# Altium project SpaceVNXBaseBoard.PrjPcb (part 6 of 6)
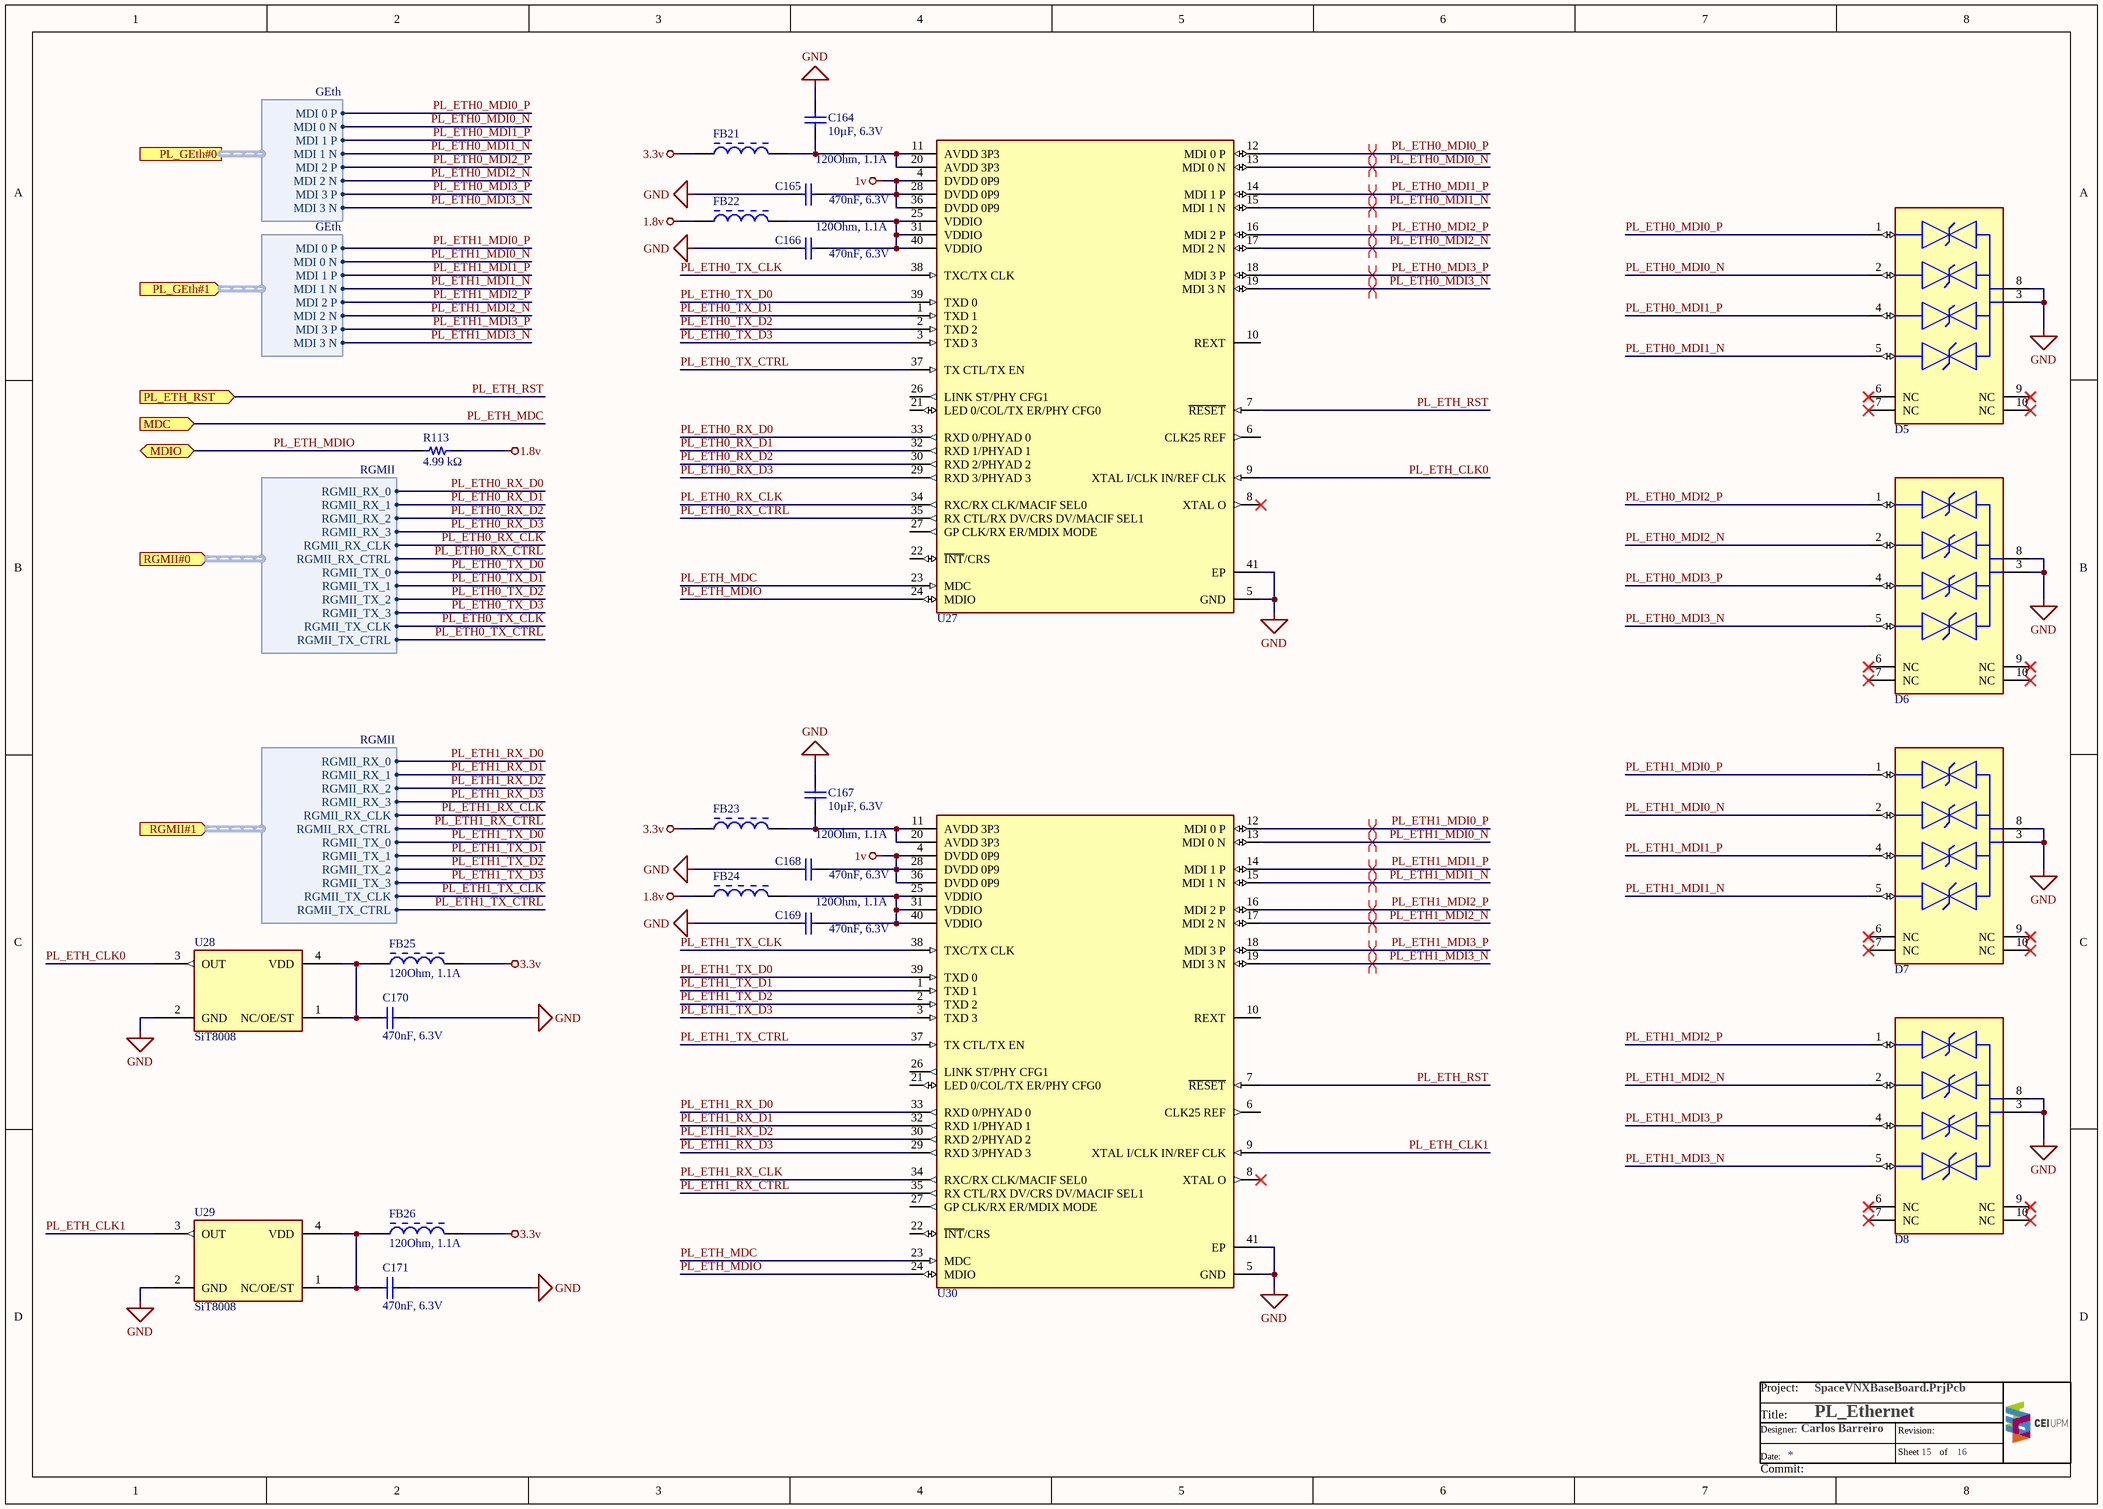
[diagram p16: PL_Ethernet.SchDoc]

## Nets that join several sheets
1.2v_MTG: ZynqPL_GTXE2 (C12.2 R30.2 U1.AB7), ZynqPower (11 pins)
1.8v: ZynqPS (C1.1 R1.1 R2.2), Clock (7 pins), PowerSupply (7 pins), ZynqPower (45 pins), PS_Ethernet (FB16.1 FB18.1 R112.2), PL_Ethernet (FB22.1 FB24.1 R113.2)
1v: PowerSupply (9 pins), ZynqPower (31 pins), PS_Ethernet (8 pins), PL_Ethernet (8 pins)
3.3v: ZynqPS (20 pins), ZynqPL (9 pins), Clock (6 pins), PowerSupply (13 pins), ZynqPower (12 pins), PS_Ethernet (FB15.1 FB17.1 FB19.2 FB20.2), CANTransceiver (C172.2 C173.2 U31.3 U32.3), PL_Ethernet (FB21.1 FB23.1 FB25.2 FB26.2)
3.3v_LDO: Clock (5 pins), CPLD (8 pins), PowerSupply (C47.1 R91.2 U11.2)
AGND: ZynqPL (6 pins), ZynqPower (C89.1 U1.M13)
GND: SpaceVNXBaseBoard (MP1.1 MP2.1 MP3.1 MP4.1), ZynqPS (29 pins), ZynqPL_DDR (R28.1 R29.1), ZynqPL_GTXE2 (C12.1), PS_DDR (55 pins), DaughterBoardInterface (8 pins), Clock (22 pins), SpaceVNXInterface (115 pins), CPLD (6 pins), PowerSupply (85 pins), ZynqPower (155 pins), PS_Ethernet (22 pins), CANTransceiver (8 pins), PL_Ethernet (22 pins)
VCCO_PL_DDR: ZynqPL_DDR (R25.2 R26.2), PowerSupply (5 pins), ZynqPower (21 pins)
VCCO_PS_DDR: ZynqPS (R9.2), PS_DDR (36 pins), PowerSupply (5 pins), ZynqPower (11 pins)
VIN: SpaceVNXInterface (12 pins), PowerSupply (35 pins)
VTT_PS_DDR: PS_DDR (32 pins), PowerSupply (5 pins)
VTT_PS_REF: ZynqPS (C2.2 C3.2 U1.K21 U1.M21), PS_DDR (6 pins), PowerSupply (C70.2 U15.6)
CAN0_H: SpaceVNXInterface (J4.C21), CANTransceiver (U32.7)
CAN0_L: SpaceVNXInterface (J4.B20), CANTransceiver (U32.6)
CAN0_RXD: ZynqPS (U1.E18), CANTransceiver (U32.4)
CAN0_TXD: ZynqPS (U1.C18), CANTransceiver (U32.1)
CAN1_H: SpaceVNXInterface (J4.B22), CANTransceiver (U31.7)
CAN1_L: SpaceVNXInterface (J4.C23), CANTransceiver (U31.6)
CAN1_RXD: ZynqPS (U1.E17), CANTransceiver (U31.4)
CAN1_TXD: ZynqPS (U1.B19), CANTransceiver (U31.1)
CAN_LOOPBACK: ZynqPL (U1.AE13), CANTransceiver (R115.1 R117.1 U31.5 U32.5)
CAN_LOWPOWER: ZynqPL (U1.AF13), CANTransceiver (R114.1 R116.1 U31.8 U32.8)
CLK0: ZynqPS (U1.B24), Clock (U18.3)
CLKin0_N: Clock (U20.32), SpaceVNXInterface (J4.D41)
CLKin0_P: Clock (U20.33), SpaceVNXInterface (J4.D42)
CLKin1_N: Clock (U20.29), SpaceVNXInterface (J4.D37)
CLKin1_P: Clock (U20.30), SpaceVNXInterface (J4.D38)
CLKin_SEL: ZynqPL (U1.AF17), Clock (U20.34)
DEVCLK_DC1_N: DaughterBoardInterface (J2.20), Clock (U20.19)
DEVCLK_DC1_P: DaughterBoardInterface (J2.18), Clock (U20.18)
DEVCLK_DC2_N: DaughterBoardInterface (J2.19), Clock (U20.24)
DEVCLK_DC2_P: DaughterBoardInterface (J2.17), Clock (U20.23)
DEVCLK_LD1_N: ZynqPL_GTXE2 (C14.2), Clock (U20.49)
DEVCLK_LD1_P: ZynqPL_GTXE2 (C13.2), Clock (U20.50)
DEVCLK_LD2_N: ZynqPL_GTXE2 (C18.2), Clock (U20.54)
DEVCLK_LD2_P: ZynqPL_GTXE2 (C17.2), Clock (U20.55)
eMMC_RST: ZynqPS (U2.K5), CPLD (U22.29)
ENABLE_1.8v: CPLD (U22.42), PowerSupply (U14.E4)
ENABLE_1v: CPLD (U22.21), PowerSupply (U16.E4)
ENABLE_3.3v: CPLD (U22.41), PowerSupply (U12.E4)
GTX111_RX0_N: ZynqPL_GTXE2 (U1.AD3), DaughterBoardInterface (J2.28)
GTX111_RX0_P: ZynqPL_GTXE2 (U1.AD4), DaughterBoardInterface (J2.26)
GTX111_RX1_N: ZynqPL_GTXE2 (U1.AC5), DaughterBoardInterface (J2.32)
GTX111_RX1_P: ZynqPL_GTXE2 (U1.AC6), DaughterBoardInterface (J2.30)
GTX111_RX2_N: ZynqPL_GTXE2 (U1.AE5), DaughterBoardInterface (J2.36)
GTX111_RX2_P: ZynqPL_GTXE2 (U1.AE6), DaughterBoardInterface (J2.34)
GTX111_RX3_N: ZynqPL_GTXE2 (U1.AD7), DaughterBoardInterface (J2.40)
GTX111_RX3_P: ZynqPL_GTXE2 (U1.AD8), DaughterBoardInterface (J2.38)
GTX111_TX0_N: ZynqPL_GTXE2 (U1.AC1), DaughterBoardInterface (C155.2)
GTX111_TX0_P: ZynqPL_GTXE2 (U1.AC2), DaughterBoardInterface (C154.2)
GTX111_TX1_N: ZynqPL_GTXE2 (U1.AE1), DaughterBoardInterface (C153.2)
GTX111_TX1_P: ZynqPL_GTXE2 (U1.AE2), DaughterBoardInterface (C152.2)
GTX111_TX2_N: ZynqPL_GTXE2 (U1.AF3), DaughterBoardInterface (C151.2)
GTX111_TX2_P: ZynqPL_GTXE2 (U1.AF4), DaughterBoardInterface (C150.2)
GTX111_TX3_N: ZynqPL_GTXE2 (U1.AF7), DaughterBoardInterface (C149.2)
GTX111_TX3_P: ZynqPL_GTXE2 (U1.AF8), DaughterBoardInterface (C148.2)
GTX112_RX0_N: ZynqPL_GTXE2 (U1.AB3), DaughterBoardInterface (J2.04)
GTX112_RX0_P: ZynqPL_GTXE2 (U1.AB4), DaughterBoardInterface (J2.02)
GTX112_RX1_N: ZynqPL_GTXE2 (U1.Y3), DaughterBoardInterface (J2.08)
GTX112_RX1_P: ZynqPL_GTXE2 (U1.Y4), DaughterBoardInterface (J2.06)
GTX112_RX2_N: ZynqPL_GTXE2 (U1.V3), DaughterBoardInterface (J2.12)
GTX112_RX2_P: ZynqPL_GTXE2 (U1.V4), DaughterBoardInterface (J2.10)
GTX112_RX3_N: ZynqPL_GTXE2 (U1.T3), DaughterBoardInterface (J2.16)
GTX112_RX3_P: ZynqPL_GTXE2 (U1.T4), DaughterBoardInterface (J2.14)
GTX112_TX0_N: ZynqPL_GTXE2 (U1.AA1), DaughterBoardInterface (C141.2)
GTX112_TX0_P: ZynqPL_GTXE2 (U1.AA2), DaughterBoardInterface (C140.2)
GTX112_TX1_N: ZynqPL_GTXE2 (U1.W1), DaughterBoardInterface (C143.2)
GTX112_TX1_P: ZynqPL_GTXE2 (U1.W2), DaughterBoardInterface (C142.2)
GTX112_TX2_N: ZynqPL_GTXE2 (U1.U1), DaughterBoardInterface (C145.2)
GTX112_TX2_P: ZynqPL_GTXE2 (U1.U2), DaughterBoardInterface (C144.2)
GTX112_TX3_N: ZynqPL_GTXE2 (U1.R1), DaughterBoardInterface (C147.2)
GTX112_TX3_P: ZynqPL_GTXE2 (U1.R2), DaughterBoardInterface (C146.2)
OUT1_N: ZynqPL_DDR (C11.2), Clock (U19.5)
OUT1_P: ZynqPL_DDR (C10.2), Clock (U19.4)
PGOOD_1.8v: CPLD (U22.47), PowerSupply (R99.1 U14.F4)
PGOOD_1v: CPLD (U22.48), PowerSupply (R104.1 U16.F4)
PGOOD_3.3v: CPLD (U22.46), PowerSupply (R92.1 U12.F4)
PL_DDR_A0: ZynqPL_DDR (U1.J11), PL_DDR (J6.107)
PL_DDR_A1: ZynqPL_DDR (U1.H11), PL_DDR (J6.105)
PL_DDR_A2: ZynqPL_DDR (U1.G6), PL_DDR (J6.106)
PL_DDR_A3: ZynqPL_DDR (U1.G5), PL_DDR (J6.103)
PL_DDR_A4: ZynqPL_DDR (U1.G9), PL_DDR (J6.104)
PL_DDR_A5: ZynqPL_DDR (U1.H7), PL_DDR (J6.99)
PL_DDR_A6: ZynqPL_DDR (U1.H6), PL_DDR (J6.100)
PL_DDR_A7: ZynqPL_DDR (U1.J10), PL_DDR (J6.98)
PL_DDR_A8: ZynqPL_DDR (U1.J9), PL_DDR (J6.97)
PL_DDR_A9: ZynqPL_DDR (U1.F5), PL_DDR (J6.92)
PL_DDR_A10: ZynqPL_DDR (U1.E5), PL_DDR (J6.117)
PL_DDR_A11: ZynqPL_DDR (U1.D9), PL_DDR (J6.96)
PL_DDR_A12: ZynqPL_DDR (U1.D8), PL_DDR (J6.95)
PL_DDR_A13: ZynqPL_DDR (U1.F9), PL_DDR (J6.130)
PL_DDR_A14: ZynqPL_DDR (U1.E8), PL_DDR (J6.90)
PL_DDR_BA0: ZynqPL_DDR (U1.A8), PL_DDR (J6.119)
PL_DDR_BA1: ZynqPL_DDR (U1.B7), PL_DDR (J6.108)
PL_DDR_BA2: ZynqPL_DDR (U1.A7), PL_DDR (J6.91)
PL_DDR_CAS: ZynqPL_DDR (U1.D5), PL_DDR (J6.125)
PL_DDR_CKE: ZynqPL_DDR (U1.B9), PL_DDR (J6.87)
PL_DDR_CLK_N: ZynqPL_DDR (U1.F7), PL_DDR (J6.111)
PL_DDR_CLK_P: ZynqPL_DDR (U1.G7), PL_DDR (J6.113)
PL_DDR_CS: ZynqPL_DDR (U1.J8), PL_DDR (J6.127)
PL_DDR_DM_Byte0: ZynqPL_DDR (U1.F13), PL_DDR (J6.11)
PL_DDR_DM_Byte1: ZynqPL_DDR (U1.D15), PL_DDR (J6.28)
PL_DDR_DM_Byte2: ZynqPL_DDR (U1.D14), PL_DDR (J6.44)
PL_DDR_DM_Byte3: ZynqPL_DDR (U1.D13), PL_DDR (J6.59)
PL_DDR_DM_Byte4: ZynqPL_DDR (U1.F3), PL_DDR (J6.140)
PL_DDR_DM_Byte5: ZynqPL_DDR (U1.M6), PL_DDR (J6.157)
PL_DDR_DM_Byte6: ZynqPL_DDR (U1.M5), PL_DDR (J6.172)
PL_DDR_DM_Byte7: ZynqPL_DDR (U1.M7), PL_DDR (J6.189)
PL_DDR_DM_Byte8: ZynqPL_DDR (U1.C4), PL_DDR (J6.76)
PL_DDR_DQ0: ZynqPL_DDR (U1.F12), PL_DDR (J6.5)
PL_DDR_DQ1: ZynqPL_DDR (U1.E12), PL_DDR (J6.7)
PL_DDR_DQ2: ZynqPL_DDR (U1.E10), PL_DDR (J6.13)
PL_DDR_DQ3: ZynqPL_DDR (U1.D10), PL_DDR (J6.15)
PL_DDR_DQ4: ZynqPL_DDR (U1.E11), PL_DDR (J6.4)
PL_DDR_DQ5: ZynqPL_DDR (U1.D11), PL_DDR (J6.6)
PL_DDR_DQ6: ZynqPL_DDR (U1.G12), PL_DDR (J6.16)
PL_DDR_DQ7: ZynqPL_DDR (U1.G11), PL_DDR (J6.18)
PL_DDR_DQ8: ZynqPL_DDR (U1.H13), PL_DDR (J6.19)
PL_DDR_DQ9: ZynqPL_DDR (U1.H12), PL_DDR (J6.21)
PL_DDR_DQ10: ZynqPL_DDR (U1.K13), PL_DDR (J6.31)
PL_DDR_DQ11: ZynqPL_DDR (U1.J13), PL_DDR (J6.33)
PL_DDR_DQ12: ZynqPL_DDR (U1.G16), PL_DDR (J6.22)
PL_DDR_DQ13: ZynqPL_DDR (U1.G15), PL_DDR (J6.24)
PL_DDR_DQ14: ZynqPL_DDR (U1.G14), PL_DDR (J6.34)
PL_DDR_DQ15: ZynqPL_DDR (U1.F14), PL_DDR (J6.36)
PL_DDR_DQ16: ZynqPL_DDR (U1.F15), PL_DDR (J6.37)
PL_DDR_DQ17: ZynqPL_DDR (U1.E15), PL_DDR (J6.39)
PL_DDR_DQ18: ZynqPL_DDR (U1.E16), PL_DDR (J6.49)
PL_DDR_DQ19: ZynqPL_DDR (U1.D16), PL_DDR (J6.51)
PL_DDR_DQ20: ZynqPL_DDR (U1.B16), PL_DDR (J6.40)
PL_DDR_DQ21: ZynqPL_DDR (U1.B15), PL_DDR (J6.42)
PL_DDR_DQ22: ZynqPL_DDR (U1.B17), PL_DDR (J6.48)
PL_DDR_DQ23: ZynqPL_DDR (U1.A17), PL_DDR (J6.50)
PL_DDR_DQ24: ZynqPL_DDR (U1.C14), PL_DDR (J6.55)
PL_DDR_DQ25: ZynqPL_DDR (U1.B14), PL_DDR (J6.57)
PL_DDR_DQ26: ZynqPL_DDR (U1.C12), PL_DDR (J6.63)
PL_DDR_DQ27: ZynqPL_DDR (U1.B12), PL_DDR (J6.65)
PL_DDR_DQ28: ZynqPL_DDR (U1.C11), PL_DDR (J6.54)
PL_DDR_DQ29: ZynqPL_DDR (U1.B11), PL_DDR (J6.56)
PL_DDR_DQ30: ZynqPL_DDR (U1.A13), PL_DDR (J6.66)
PL_DDR_DQ31: ZynqPL_DDR (U1.A12), PL_DDR (J6.68)
PL_DDR_DQ32: ZynqPL_DDR (U1.G4), PL_DDR (J6.133)
PL_DDR_DQ33: ZynqPL_DDR (U1.F4), PL_DDR (J6.135)
PL_DDR_DQ34: ZynqPL_DDR (U1.D4), PL_DDR (J6.145)
PL_DDR_DQ35: ZynqPL_DDR (U1.D3), PL_DDR (J6.147)
PL_DDR_DQ36: ZynqPL_DDR (U1.D1), PL_DDR (J6.134)
PL_DDR_DQ37: ZynqPL_DDR (U1.C1), PL_DDR (J6.136)
PL_DDR_DQ38: ZynqPL_DDR (U1.E2), PL_DDR (J6.142)
PL_DDR_DQ39: ZynqPL_DDR (U1.E1), PL_DDR (J6.144)
PL_DDR_DQ40: ZynqPL_DDR (U1.J1), PL_DDR (J6.151)
PL_DDR_DQ41: ZynqPL_DDR (U1.H1), PL_DDR (J6.153)
PL_DDR_DQ42: ZynqPL_DDR (U1.H4), PL_DDR (J6.159)
PL_DDR_DQ43: ZynqPL_DDR (U1.H3), PL_DDR (J6.161)
PL_DDR_DQ44: ZynqPL_DDR (U1.H2), PL_DDR (J6.148)
PL_DDR_DQ45: ZynqPL_DDR (U1.G1), PL_DDR (J6.150)
PL_DDR_DQ46: ZynqPL_DDR (U1.L3), PL_DDR (J6.160)
PL_DDR_DQ47: ZynqPL_DDR (U1.K3), PL_DDR (J6.162)
PL_DDR_DQ48: ZynqPL_DDR (U1.L5), PL_DDR (J6.165)
PL_DDR_DQ49: ZynqPL_DDR (U1.L4), PL_DDR (J6.167)
PL_DDR_DQ50: ZynqPL_DDR (U1.M2), PL_DDR (J6.177)
PL_DDR_DQ51: ZynqPL_DDR (U1.L2), PL_DDR (J6.179)
PL_DDR_DQ52: ZynqPL_DDR (U1.N4), PL_DDR (J6.166)
PL_DDR_DQ53: ZynqPL_DDR (U1.M4), PL_DDR (J6.168)
PL_DDR_DQ54: ZynqPL_DDR (U1.N1), PL_DDR (J6.174)
PL_DDR_DQ55: ZynqPL_DDR (U1.M1), PL_DDR (J6.176)
PL_DDR_DQ56: ZynqPL_DDR (U1.K5), PL_DDR (J6.183)
PL_DDR_DQ57: ZynqPL_DDR (U1.J5), PL_DDR (J6.185)
PL_DDR_DQ58: ZynqPL_DDR (U1.K6), PL_DDR (J6.191)
PL_DDR_DQ59: ZynqPL_DDR (U1.J6), PL_DDR (J6.193)
PL_DDR_DQ60: ZynqPL_DDR (U1.N7), PL_DDR (J6.180)
PL_DDR_DQ61: ZynqPL_DDR (U1.N6), PL_DDR (J6.182)
PL_DDR_DQ62: ZynqPL_DDR (U1.K8), PL_DDR (J6.192)
PL_DDR_DQ63: ZynqPL_DDR (U1.K7), PL_DDR (J6.194)
PL_DDR_DQ64: ZynqPL_DDR (U1.C2), PL_DDR (J6.69)
PL_DDR_DQ65: ZynqPL_DDR (U1.A2), PL_DDR (J6.71)
PL_DDR_DQ66: ZynqPL_DDR (U1.B4), PL_DDR (J6.81)
PL_DDR_DQ67: ZynqPL_DDR (U1.B5), PL_DDR (J6.83)
PL_DDR_DQ68: ZynqPL_DDR (U1.A3), PL_DDR (J6.72)
PL_DDR_DQ69: ZynqPL_DDR (U1.A4), PL_DDR (J6.74)
PL_DDR_DQ70: ZynqPL_DDR (U1.B1), PL_DDR (J6.80)
PL_DDR_DQ71: ZynqPL_DDR (U1.B2), PL_DDR (J6.82)
PL_DDR_DQS_Byte0_N: ZynqPL_DDR (U1.F10), PL_DDR (J6.10)
PL_DDR_DQS_Byte0_P: ZynqPL_DDR (U1.G10), PL_DDR (J6.12)
PL_DDR_DQS_Byte1_N: ZynqPL_DDR (U1.J15), PL_DDR (J6.25)
PL_DDR_DQS_Byte1_P: ZynqPL_DDR (U1.K15), PL_DDR (J6.27)
PL_DDR_DQS_Byte2_N: ZynqPL_DDR (U1.C16), PL_DDR (J6.43)
PL_DDR_DQS_Byte2_P: ZynqPL_DDR (U1.C17), PL_DDR (J6.45)
PL_DDR_DQS_Byte3_N: ZynqPL_DDR (U1.A14), PL_DDR (J6.60)
PL_DDR_DQS_Byte3_P: ZynqPL_DDR (U1.A15), PL_DDR (J6.62)
PL_DDR_DQS_Byte4_N: ZynqPL_DDR (U1.G2), PL_DDR (J6.139)
PL_DDR_DQS_Byte4_P: ZynqPL_DDR (U1.F2), PL_DDR (J6.141)
PL_DDR_DQS_Byte5_N: ZynqPL_DDR (U1.K2), PL_DDR (J6.154)
PL_DDR_DQS_Byte5_P: ZynqPL_DDR (U1.K1), PL_DDR (J6.156)
PL_DDR_DQS_Byte6_N: ZynqPL_DDR (U1.N3), PL_DDR (J6.171)
PL_DDR_DQS_Byte6_P: ZynqPL_DDR (U1.N2), PL_DDR (J6.173)
PL_DDR_DQS_Byte7_N: ZynqPL_DDR (U1.M8), PL_DDR (J6.186)
PL_DDR_DQS_Byte7_P: ZynqPL_DDR (U1.L8), PL_DDR (J6.188)
PL_DDR_DQS_Byte8_N: ZynqPL_DDR (U1.B6), PL_DDR (J6.75)
PL_DDR_DQS_Byte8_P: ZynqPL_DDR (U1.A5), PL_DDR (J6.77)
PL_DDR_ODT: ZynqPL_DDR (U1.C9), PL_DDR (J6.126)
PL_DDR_RAS: ZynqPL_DDR (U1.E6), PL_DDR (J6.122)
PL_DDR_RST: ZynqPL_DDR (U1.B10), PL_DDR (J6.30)
PL_DDR_WE: ZynqPL_DDR (U1.A10), PL_DDR (J6.121)
PL_DONE: ZynqPL (R22.2 U1.W9), CPLD (U22.31)
PL_ETH0_MDI0_N: SpaceVNXInterface (J4.C32), PL_Ethernet (D5.2 U27.13)
PL_ETH0_MDI0_P: SpaceVNXInterface (J4.B31), PL_Ethernet (D5.1 U27.12)
PL_ETH0_MDI1_N: SpaceVNXInterface (J4.B29), PL_Ethernet (D5.5 U27.15)
PL_ETH0_MDI1_P: SpaceVNXInterface (J4.C30), PL_Ethernet (D5.4 U27.14)
PL_ETH0_MDI2_N: SpaceVNXInterface (J4.C28), PL_Ethernet (D6.2 U27.17)
PL_ETH0_MDI2_P: SpaceVNXInterface (J4.B27), PL_Ethernet (D6.1 U27.16)
PL_ETH0_MDI3_N: SpaceVNXInterface (J4.B25), PL_Ethernet (D6.5 U27.19)
PL_ETH0_MDI3_P: SpaceVNXInterface (J4.C26), PL_Ethernet (D6.4 U27.18)
PL_ETH0_RX_CLK: ZynqPL (U1.W18), PL_Ethernet (U27.34)
PL_ETH0_RX_CTRL: ZynqPL (U1.W19), PL_Ethernet (U27.35)
PL_ETH0_RX_D0: ZynqPL (U1.AE20), PL_Ethernet (U27.33)
PL_ETH0_RX_D1: ZynqPL (U1.AE21), PL_Ethernet (U27.32)
PL_ETH0_RX_D2: ZynqPL (U1.AD18), PL_Ethernet (U27.30)
PL_ETH0_RX_D3: ZynqPL (U1.AD19), PL_Ethernet (U27.29)
PL_ETH0_TX_CLK: ZynqPL (U1.AA19), PL_Ethernet (U27.38)
PL_ETH0_TX_CTRL: ZynqPL (U1.AB19), PL_Ethernet (U27.37)
PL_ETH0_TX_D0: ZynqPL (U1.AE18), PL_Ethernet (U27.39)
PL_ETH0_TX_D1: ZynqPL (U1.AF18), PL_Ethernet (U27.1)
PL_ETH0_TX_D2: ZynqPL (U1.AA20), PL_Ethernet (U27.2)
PL_ETH0_TX_D3: ZynqPL (U1.AB20), PL_Ethernet (U27.3)
PL_ETH1_MDI0_N: SpaceVNXInterface (J4.C41), PL_Ethernet (D7.2 U30.13)
PL_ETH1_MDI0_P: SpaceVNXInterface (J4.B40), PL_Ethernet (D7.1 U30.12)
PL_ETH1_MDI1_N: SpaceVNXInterface (J4.B38), PL_Ethernet (D7.5 U30.15)
PL_ETH1_MDI1_P: SpaceVNXInterface (J4.C39), PL_Ethernet (D7.4 U30.14)
PL_ETH1_MDI2_N: SpaceVNXInterface (J4.C37), PL_Ethernet (D8.2 U30.17)
PL_ETH1_MDI2_P: SpaceVNXInterface (J4.B36), PL_Ethernet (D8.1 U30.16)
PL_ETH1_MDI3_N: SpaceVNXInterface (J4.B34), PL_Ethernet (D8.5 U30.19)
PL_ETH1_MDI3_P: SpaceVNXInterface (J4.C35), PL_Ethernet (D8.4 U30.18)
PL_ETH1_RX_CLK: ZynqPL (U1.AA25), PL_Ethernet (U30.34)
PL_ETH1_RX_CTRL: ZynqPL (U1.AB25), PL_Ethernet (U30.35)
PL_ETH1_RX_D0: ZynqPL (U1.AD25), PL_Ethernet (U30.33)
PL_ETH1_RX_D1: ZynqPL (U1.AD26), PL_Ethernet (U30.32)
PL_ETH1_RX_D2: ZynqPL (U1.AF24), PL_Ethernet (U30.30)
PL_ETH1_RX_D3: ZynqPL (U1.AF25), PL_Ethernet (U30.29)
PL_ETH1_TX_CLK: ZynqPL (U1.AB26), PL_Ethernet (U30.38)
PL_ETH1_TX_CTRL: ZynqPL (U1.AC26), PL_Ethernet (U30.37)
PL_ETH1_TX_D0: ZynqPL (U1.AE22), PL_Ethernet (U30.39)
PL_ETH1_TX_D1: ZynqPL (U1.AF22), PL_Ethernet (U30.1)
PL_ETH1_TX_D2: ZynqPL (U1.AE23), PL_Ethernet (U30.2)
PL_ETH1_TX_D3: ZynqPL (U1.AF23), PL_Ethernet (U30.3)
PL_ETH_MDC: ZynqPL (U1.Y18), PL_Ethernet (U27.23 U30.23)
PL_ETH_MDIO: ZynqPL (U1.AA18), PL_Ethernet (R113.1 U27.24 U30.24)
PL_ETH_RST: ZynqPL (U1.W20), PL_Ethernet (U27.7 U30.7)
PL_INIT: ZynqPL (R23.2 U1.R8), CPLD (U22.37)
PL_PROG: ZynqPL (R24.2 U1.V9), CPLD (U22.32)
PL_PUDC: ZynqPL_DDR (U1.H9), CPLD (U22.30)
PLL_LOCK: ZynqPL (U1.AE15), Clock (U20.9)
PS_DDR_A0: ZynqPS (U1.K22), PS_DDR (R88.2 U9.N3 U10.N3)
PS_DDR_A1: ZynqPS (U1.K20), PS_DDR (R87.2 U9.P7 U10.P7)
PS_DDR_A2: ZynqPS (U1.N21), PS_DDR (R86.2 U9.P3 U10.P3)
PS_DDR_A3: ZynqPS (U1.L22), PS_DDR (R85.2 U9.N2 U10.N2)
PS_DDR_A4: ZynqPS (U1.M20), PS_DDR (R84.2 U9.P8 U10.P8)
PS_DDR_A5: ZynqPS (U1.N22), PS_DDR (R83.2 U9.P2 U10.P2)
PS_DDR_A6: ZynqPS (U1.L20), PS_DDR (R82.2 U9.R8 U10.R8)
PS_DDR_A7: ZynqPS (U1.J21), PS_DDR (R81.2 U9.R2 U10.R2)
PS_DDR_A8: ZynqPS (U1.T20), PS_DDR (R80.2 U9.T8 U10.T8)
PS_DDR_A9: ZynqPS (U1.U20), PS_DDR (R79.2 U9.R3 U10.R3)
PS_DDR_A10: ZynqPS (U1.M22), PS_DDR (R78.2 U9.L7 U10.L7)
PS_DDR_A11: ZynqPS (U1.H21), PS_DDR (R77.2 U9.R7 U10.R7)
PS_DDR_A12: ZynqPS (U1.P20), PS_DDR (R76.2 U9.N7 U10.N7)
PS_DDR_A13: ZynqPS (U1.J20), PS_DDR (R75.2 U9.T3 U10.T3)
PS_DDR_A14: ZynqPS (U1.R20), PS_DDR (R74.2 U9.T7 U10.T7)
PS_DDR_BA0: ZynqPS (U1.U22), PS_DDR (R73.2 U9.M2 U10.M2)
PS_DDR_BA1: ZynqPS (U1.T22), PS_DDR (R72.2 U9.N8 U10.N8)
PS_DDR_BA2: ZynqPS (U1.R22), PS_DDR (R71.2 U9.M3 U10.M3)
PS_DDR_CAS: ZynqPS (U1.Y23), PS_DDR (R69.2 U9.K3 U10.K3)
PS_DDR_CKE: ZynqPS (U1.U21), PS_DDR (R67.2 U9.K9 U10.K9)
PS_DDR_CLK_N: ZynqPS (U1.P21), PS_DDR (R89.2 U9.K7 U10.K7)
PS_DDR_CLK_P: ZynqPS (U1.R21), PS_DDR (R89.1 U9.J7 U10.J7)
PS_DDR_CS: ZynqPS (U1.Y21), PS_DDR (R68.2 U9.L2 U10.L2)
PS_DDR_DM_Byte0: ZynqPS (U1.G24), PS_DDR (U9.E7)
PS_DDR_DM_Byte1: ZynqPS (U1.K25), PS_DDR (U9.D3)
PS_DDR_DM_Byte2: ZynqPS (U1.P26), PS_DDR (U10.E7)
PS_DDR_DM_Byte3: ZynqPS (U1.V26), PS_DDR (U10.D3)
PS_DDR_DQ0: ZynqPS (U1.J26), PS_DDR (U9.E3)
PS_DDR_DQ1: ZynqPS (U1.F25), PS_DDR (U9.F7)
PS_DDR_DQ2: ZynqPS (U1.J25), PS_DDR (U9.F2)
PS_DDR_DQ3: ZynqPS (U1.G26), PS_DDR (U9.F8)
PS_DDR_DQ4: ZynqPS (U1.H26), PS_DDR (U9.H3)
PS_DDR_DQ5: ZynqPS (U1.H23), PS_DDR (U9.H8)
PS_DDR_DQ6: ZynqPS (U1.J24), PS_DDR (U9.G2)
PS_DDR_DQ7: ZynqPS (U1.J23), PS_DDR (U9.H7)
PS_DDR_DQ8: ZynqPS (U1.K26), PS_DDR (U9.D7)
PS_DDR_DQ9: ZynqPS (U1.L23), PS_DDR (U9.C3)
PS_DDR_DQ10: ZynqPS (U1.M26), PS_DDR (U9.C8)
PS_DDR_DQ11: ZynqPS (U1.K23), PS_DDR (U9.C2)
PS_DDR_DQ12: ZynqPS (U1.M25), PS_DDR (U9.A7)
PS_DDR_DQ13: ZynqPS (U1.N24), PS_DDR (U9.A2)
PS_DDR_DQ14: ZynqPS (U1.M24), PS_DDR (U9.B8)
PS_DDR_DQ15: ZynqPS (U1.N23), PS_DDR (U9.A3)
PS_DDR_DQ16: ZynqPS (U1.R26), PS_DDR (U10.E3)
PS_DDR_DQ17: ZynqPS (U1.P24), PS_DDR (U10.F7)
PS_DDR_DQ18: ZynqPS (U1.N26), PS_DDR (U10.F2)
PS_DDR_DQ19: ZynqPS (U1.P23), PS_DDR (U10.F8)
PS_DDR_DQ20: ZynqPS (U1.T24), PS_DDR (U10.H3)
PS_DDR_DQ21: ZynqPS (U1.T25), PS_DDR (U10.H8)
PS_DDR_DQ22: ZynqPS (U1.T23), PS_DDR (U10.G2)
PS_DDR_DQ23: ZynqPS (U1.R23), PS_DDR (U10.H7)
PS_DDR_DQ24: ZynqPS (U1.V24), PS_DDR (U10.D7)
PS_DDR_DQ25: ZynqPS (U1.U26), PS_DDR (U10.C3)
PS_DDR_DQ26: ZynqPS (U1.U24), PS_DDR (U10.C8)
PS_DDR_DQ27: ZynqPS (U1.U25), PS_DDR (U10.C2)
PS_DDR_DQ28: ZynqPS (U1.W26), PS_DDR (U10.A7)
PS_DDR_DQ29: ZynqPS (U1.Y25), PS_DDR (U10.A2)
PS_DDR_DQ30: ZynqPS (U1.Y26), PS_DDR (U10.B8)
PS_DDR_DQ31: ZynqPS (U1.W23), PS_DDR (U10.A3)
PS_DDR_DQS_Byte0_N: ZynqPS (U1.G25), PS_DDR (U9.G3)
PS_DDR_DQS_Byte0_P: ZynqPS (U1.H24), PS_DDR (U9.F3)
PS_DDR_DQS_Byte1_N: ZynqPS (U1.L25), PS_DDR (U9.B7)
PS_DDR_DQS_Byte1_P: ZynqPS (U1.L24), PS_DDR (U9.C7)
PS_DDR_DQS_Byte2_N: ZynqPS (U1.R25), PS_DDR (U10.G3)
PS_DDR_DQS_Byte2_P: ZynqPS (U1.P25), PS_DDR (U10.F3)
PS_DDR_DQS_Byte3_N: ZynqPS (U1.W25), PS_DDR (U10.B7)
PS_DDR_DQS_Byte3_P: ZynqPS (U1.W24), PS_DDR (U10.C7)
PS_DDR_ODT: ZynqPS (U1.Y22), PS_DDR (R65.2 U9.K1 U10.K1)
PS_DDR_RAS: ZynqPS (U1.V23), PS_DDR (R70.2 U9.J3 U10.J3)
PS_DDR_RST: ZynqPS (U1.H22), PS_DDR (R90.1 U9.T2 U10.T2)
PS_DDR_WE: ZynqPS (U1.V22), PS_DDR (R66.2 U9.L3 U10.L3)
PS_ETH0_MDI0_N: SpaceVNXInterface (J4.C9), PS_Ethernet (D1.2 U23.13)
PS_ETH0_MDI0_P: SpaceVNXInterface (J4.B8), PS_Ethernet (D1.1 U23.12)
PS_ETH0_MDI1_N: SpaceVNXInterface (J4.B6), PS_Ethernet (D1.5 U23.15)
PS_ETH0_MDI1_P: SpaceVNXInterface (J4.C7), PS_Ethernet (D1.4 U23.14)
PS_ETH0_MDI2_N: SpaceVNXInterface (J4.C5), PS_Ethernet (D2.2 U23.17)
PS_ETH0_MDI2_P: SpaceVNXInterface (J4.B4), PS_Ethernet (D2.1 U23.16)
PS_ETH0_MDI3_N: SpaceVNXInterface (J4.B2), PS_Ethernet (D2.5 U23.19)
PS_ETH0_MDI3_P: SpaceVNXInterface (J4.C3), PS_Ethernet (D2.4 U23.18)
PS_ETH0_RX_CLK: ZynqPS (U1.G22), PS_Ethernet (U23.34)
PS_ETH0_RX_CTRL: ZynqPS (U1.F18), PS_Ethernet (U23.35)
PS_ETH0_RX_D0: ZynqPS (U1.F20), PS_Ethernet (U23.33)
PS_ETH0_RX_D1: ZynqPS (U1.J19), PS_Ethernet (U23.32)
PS_ETH0_RX_D2: ZynqPS (U1.F19), PS_Ethernet (U23.30)
PS_ETH0_RX_D3: ZynqPS (U1.H17), PS_Ethernet (U23.29)
PS_ETH0_TX_CLK: ZynqPS (U1.G21), PS_Ethernet (U23.38)
PS_ETH0_TX_CTRL: ZynqPS (U1.F22), PS_Ethernet (U23.37)
PS_ETH0_TX_D0: ZynqPS (U1.G17), PS_Ethernet (U23.39)
PS_ETH0_TX_D1: ZynqPS (U1.G20), PS_Ethernet (U23.1)
PS_ETH0_TX_D2: ZynqPS (U1.G19), PS_Ethernet (U23.2)
PS_ETH0_TX_D3: ZynqPS (U1.H19), PS_Ethernet (U23.3)
PS_ETH1_MDI0_N: SpaceVNXInterface (J4.C18), PS_Ethernet (D3.2 U26.13)
PS_ETH1_MDI0_P: SpaceVNXInterface (J4.B17), PS_Ethernet (D3.1 U26.12)
PS_ETH1_MDI1_N: SpaceVNXInterface (J4.B15), PS_Ethernet (D3.5 U26.15)
PS_ETH1_MDI1_P: SpaceVNXInterface (J4.C16), PS_Ethernet (D3.4 U26.14)
PS_ETH1_MDI2_N: SpaceVNXInterface (J4.C14), PS_Ethernet (D4.2 U26.17)
PS_ETH1_MDI2_P: SpaceVNXInterface (J4.B13), PS_Ethernet (D4.1 U26.16)
PS_ETH1_MDI3_N: SpaceVNXInterface (J4.B11), PS_Ethernet (D4.5 U26.19)
PS_ETH1_MDI3_P: SpaceVNXInterface (J4.C12), PS_Ethernet (D4.4 U26.18)
PS_ETH1_RX_CLK: ZynqPS (U1.J18), PS_Ethernet (U26.34)
PS_ETH1_RX_CTRL: ZynqPS (U1.E22), PS_Ethernet (U26.35)
PS_ETH1_RX_D0: ZynqPS (U1.E20), PS_Ethernet (U26.33)
PS_ETH1_RX_D1: ZynqPS (U1.K19), PS_Ethernet (U26.32)
PS_ETH1_RX_D2: ZynqPS (U1.E21), PS_Ethernet (U26.30)
PS_ETH1_RX_D3: ZynqPS (U1.K17), PS_Ethernet (U26.29)
PS_ETH1_TX_CLK: ZynqPS (U1.J16), PS_Ethernet (U26.38)
PS_ETH1_TX_CTRL: ZynqPS (U1.C21), PS_Ethernet (U26.37)
PS_ETH1_TX_D0: ZynqPS (U1.D19), PS_Ethernet (U26.39)
PS_ETH1_TX_D1: ZynqPS (U1.K16), PS_Ethernet (U26.1)
PS_ETH1_TX_D2: ZynqPS (U1.D20), PS_Ethernet (U26.2)
PS_ETH1_TX_D3: ZynqPS (U1.D21), PS_Ethernet (U26.3)
PS_ETH_MDC: ZynqPS (U1.A20), PS_Ethernet (U23.23 U26.23)
PS_ETH_MDIO: ZynqPS (U1.A19), PS_Ethernet (R112.1 U23.24 U26.24)
PS_ETH_RST: ZynqPS (R10.2 U1.E26), PS_Ethernet (U23.7 U26.7)
PS_POR: ZynqPS (U1.C23), CPLD (U22.39)
PS_SRST: ZynqPS (U1.A22), CPLD (U22.36)
~{RESET}: ZynqPL (U1.Y17), Clock (U20.15)
SPI_CS0: ZynqPS (U1.B21), Clock (U20.12)
SPI_CS1: ZynqPL (U1.W13), DaughterBoardInterface (J3.02)
SPI_CS2: ZynqPL (U1.Y13), DaughterBoardInterface (J3.01)
SPI_MISO: ZynqPL (U1.AD10), DaughterBoardInterface (J3.08)
SPI_MOSI: ZynqPL (U1.AE10), DaughterBoardInterface (J3.06)
SPI_SCK0: ZynqPS (U1.A18), Clock (U20.13)
SPI_SCK1: ZynqPL (U1.AA13), DaughterBoardInterface (J3.04)
SPI_SDIO: ZynqPS (U1.B22), Clock (U20.11)
SPI_SDO: ZynqPS (U1.B20), Clock (U20.10)
SYSREF_DC1_N: DaughterBoardInterface (J2.24), Clock (U20.17)
SYSREF_DC1_P: DaughterBoardInterface (J2.22), Clock (U20.16)
SYSREF_DC2_N: DaughterBoardInterface (J2.23), Clock (U20.22)
SYSREF_DC2_P: DaughterBoardInterface (J2.21), Clock (U20.21)
SYSREF_LD1_N: ZynqPL_GTXE2 (C16.2), Clock (U20.47)
SYSREF_LD1_P: ZynqPL_GTXE2 (C15.2), Clock (U20.48)
SYSREF_LD2_N: ZynqPL_GTXE2 (C20.2), Clock (U20.52)
SYSREF_LD2_P: ZynqPL_GTXE2 (C19.2), Clock (U20.53)
SYSREF_REQ: ZynqPL (U1.AE17), Clock (U20.14)